# EAGLE design LandCruiser-Controller_1V1 (EAGLE 7.7.0)

## Sheet 1 of 7: MPU
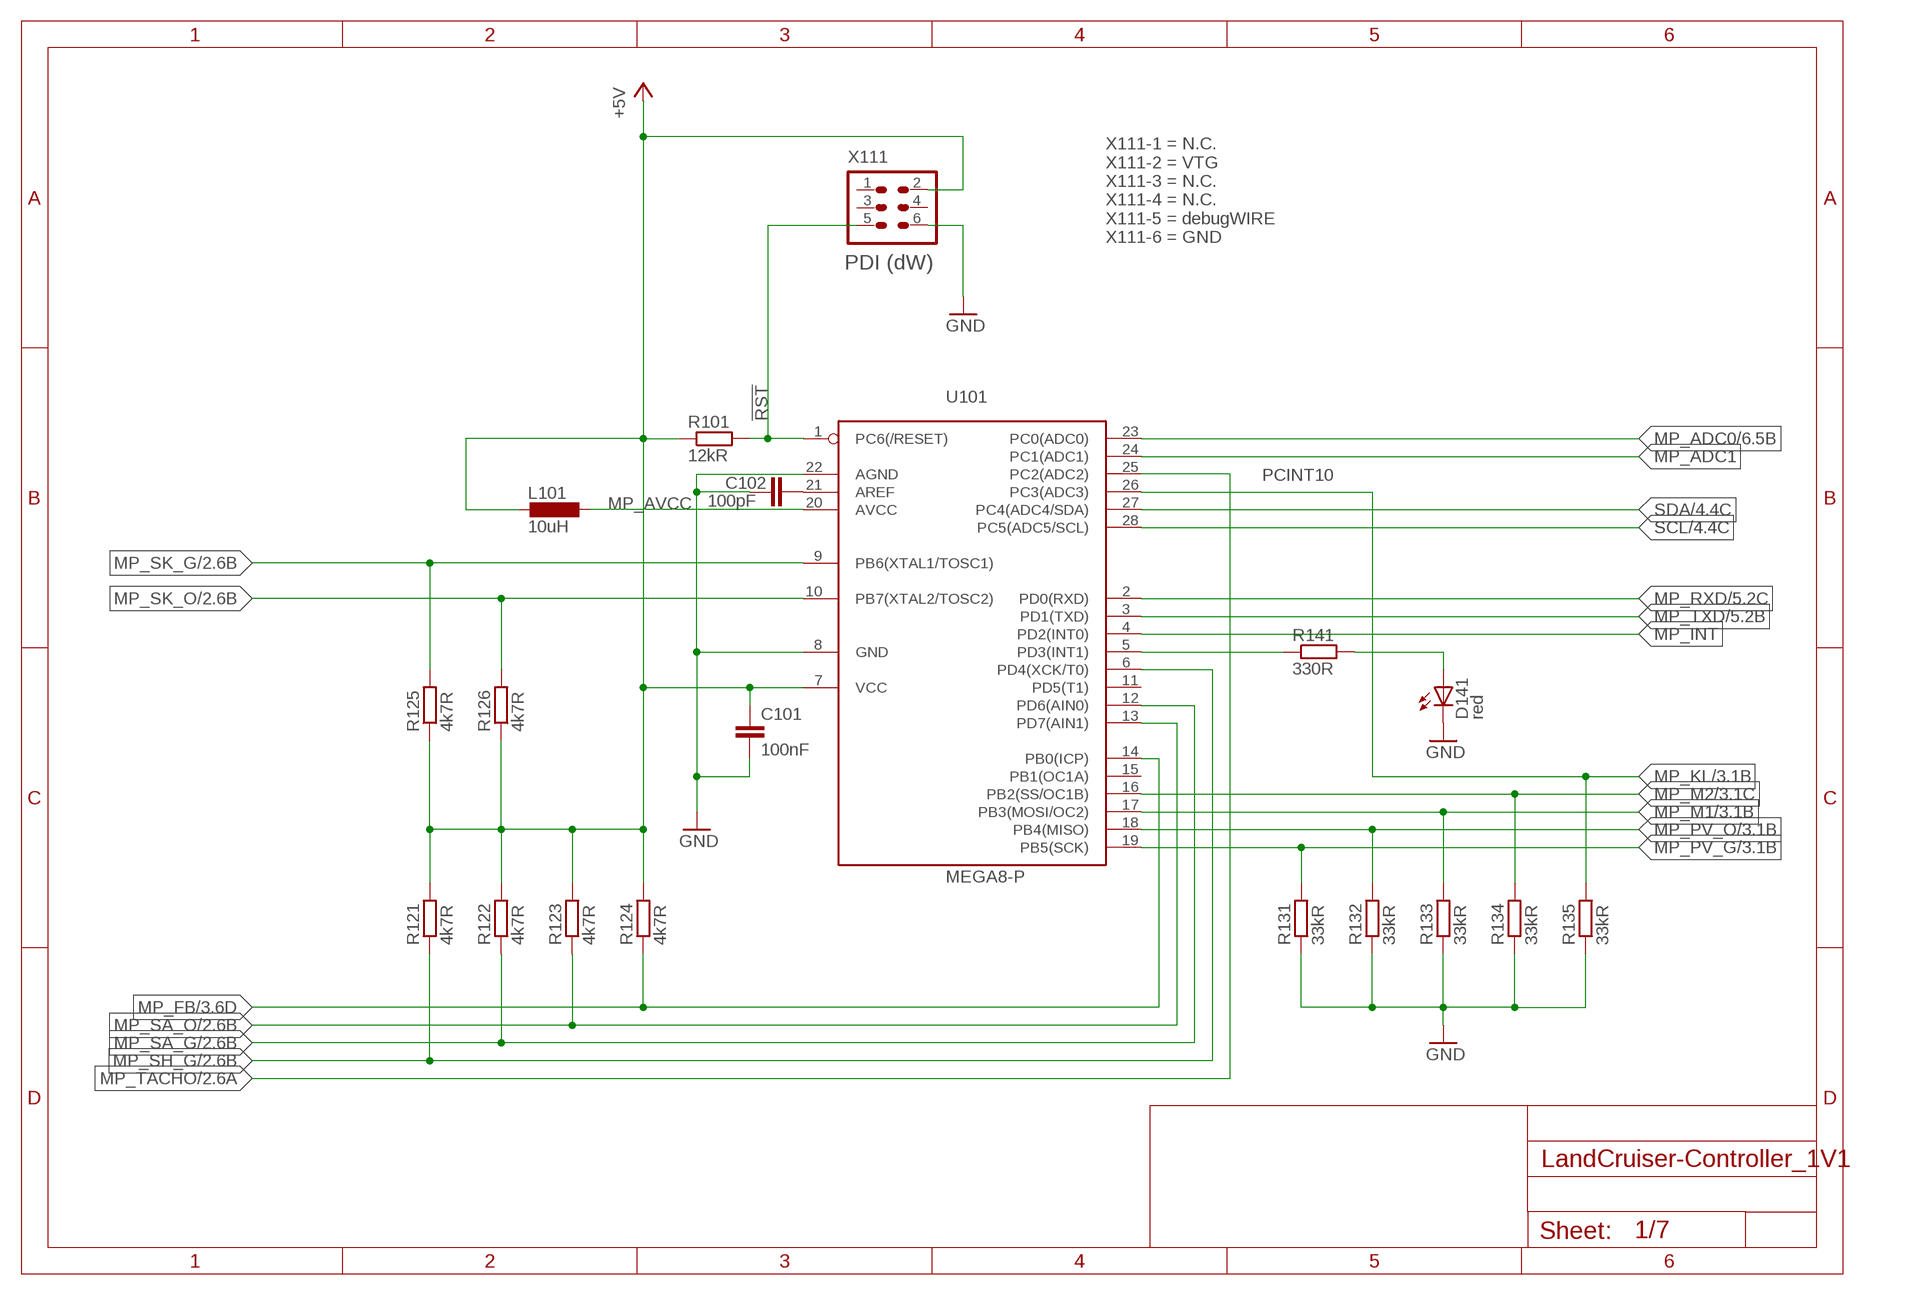
[diagram p0: schematic, sheet 1]

### Parts
C101  100nF  C-EUC0805  [C0805]
C102  100pF  C-EUC0805  [C0805]
D141  red  LED  [LED_2PIN-TTH]
L101  10uH  L-EUL1812  [L1812]
R101  12kR  R-EU_R0805  [R0805]
R121  4k7R  R-EU_R0805  [R0805]
R122  4k7R  R-EU_R0805  [R0805]
R123  4k7R  R-EU_R0805  [R0805]
R124  4k7R  R-EU_R0805  [R0805]
R125  4k7R  R-EU_R0805  [R0805]
R126  4k7R  R-EU_R0805  [R0805]
R131  33kR  R-EU_R0805  [R0805]
R132  33kR  R-EU_R0805  [R0805]
R133  33kR  R-EU_R0805  [R0805]
R134  33kR  R-EU_R0805  [R0805]
R135  33kR  R-EU_R0805  [R0805]
R141  330R  R-EU_R0805  [R0805]
U101  MEGA8-P  [DIL28-3]
X111  HEADER-2X3  [2X03]

### Nets
!RST: R101.2 U101.1(PC6(/RESET)) X111.5
+5V [pwr_ttl]: C101.1 L101.2 R101.1 R121.2 R122.2 R123.2 R124.2 R125.1 R126.1 U101.7(VCC) X111.2 ; also sheet 4,5,6
GND: C101.2 C102.1 D141.C R131.1 R132.1 R133.1 R134.1 R135.1 U101.8(GND) U101.22(AGND) X111.6 ; also sheet 2,3,4,5,6,7
LED_A: D141.A R141.2
MP_ADC0: U101.23(PC0(ADC0)) ; also sheet 6
MP_ADC1: U101.24(PC1(ADC1))
MP_AREF: C102.2 U101.21(AREF)
MP_AVCC: L101.1 U101.20(AVCC)
MP_FB: R124.1 U101.14(PB0(ICP)) ; also sheet 3
MP_INT: U101.4(PD2(INT0))
MP_KL: R135.2 U101.26(PC3(ADC3)) ; also sheet 3
MP_LED: R141.1 U101.5(PD3(INT1))
MP_M1: R133.2 U101.17(PB3(MOSI/OC2)) ; also sheet 3
MP_M2: R134.2 U101.16(PB2(SS/OC1B)) ; also sheet 3
MP_PV_G: R131.2 U101.19(PB5(SCK)) ; also sheet 3
MP_PV_O: R132.2 U101.18(PB4(MISO)) ; also sheet 3
MP_RXD: U101.2(PD0(RXD)) ; also sheet 5
MP_SA_G: R122.1 U101.12(PD6(AIN0)) ; also sheet 2
MP_SA_O: R123.1 U101.13(PD7(AIN1)) ; also sheet 2
MP_SH_G: R121.1 U101.6(PD4(XCK/T0)) ; also sheet 2
MP_SK_G: R125.2 U101.9(PB6(XTAL1/TOSC1)) ; also sheet 2
MP_SK_O: R126.2 U101.10(PB7(XTAL2/TOSC2)) ; also sheet 2
MP_TACHO: U101.25(PC2(ADC2)) ; also sheet 2
MP_TXD: U101.3(PD1(TXD)) ; also sheet 5
SCL: U101.28(PC5(ADC5/SCL)) ; also sheet 4
SDA: U101.27(PC4(ADC4/SDA)) ; also sheet 4
Unconnected: U101.11(PD5(T1)) U101.15(PB1(OC1A)) X111.1 X111.3 X111.4

### Notes on the sheet
- X111-1 = N.C.
  X111-2 = VTG
  X111-3 = N.C.
  X111-4 = N.C.
  X111-5 = debugWIRE
  X111-6 = GND
- PDI (dW)
- PCINT10

## Sheet 2 of 7: INPUT_Lines
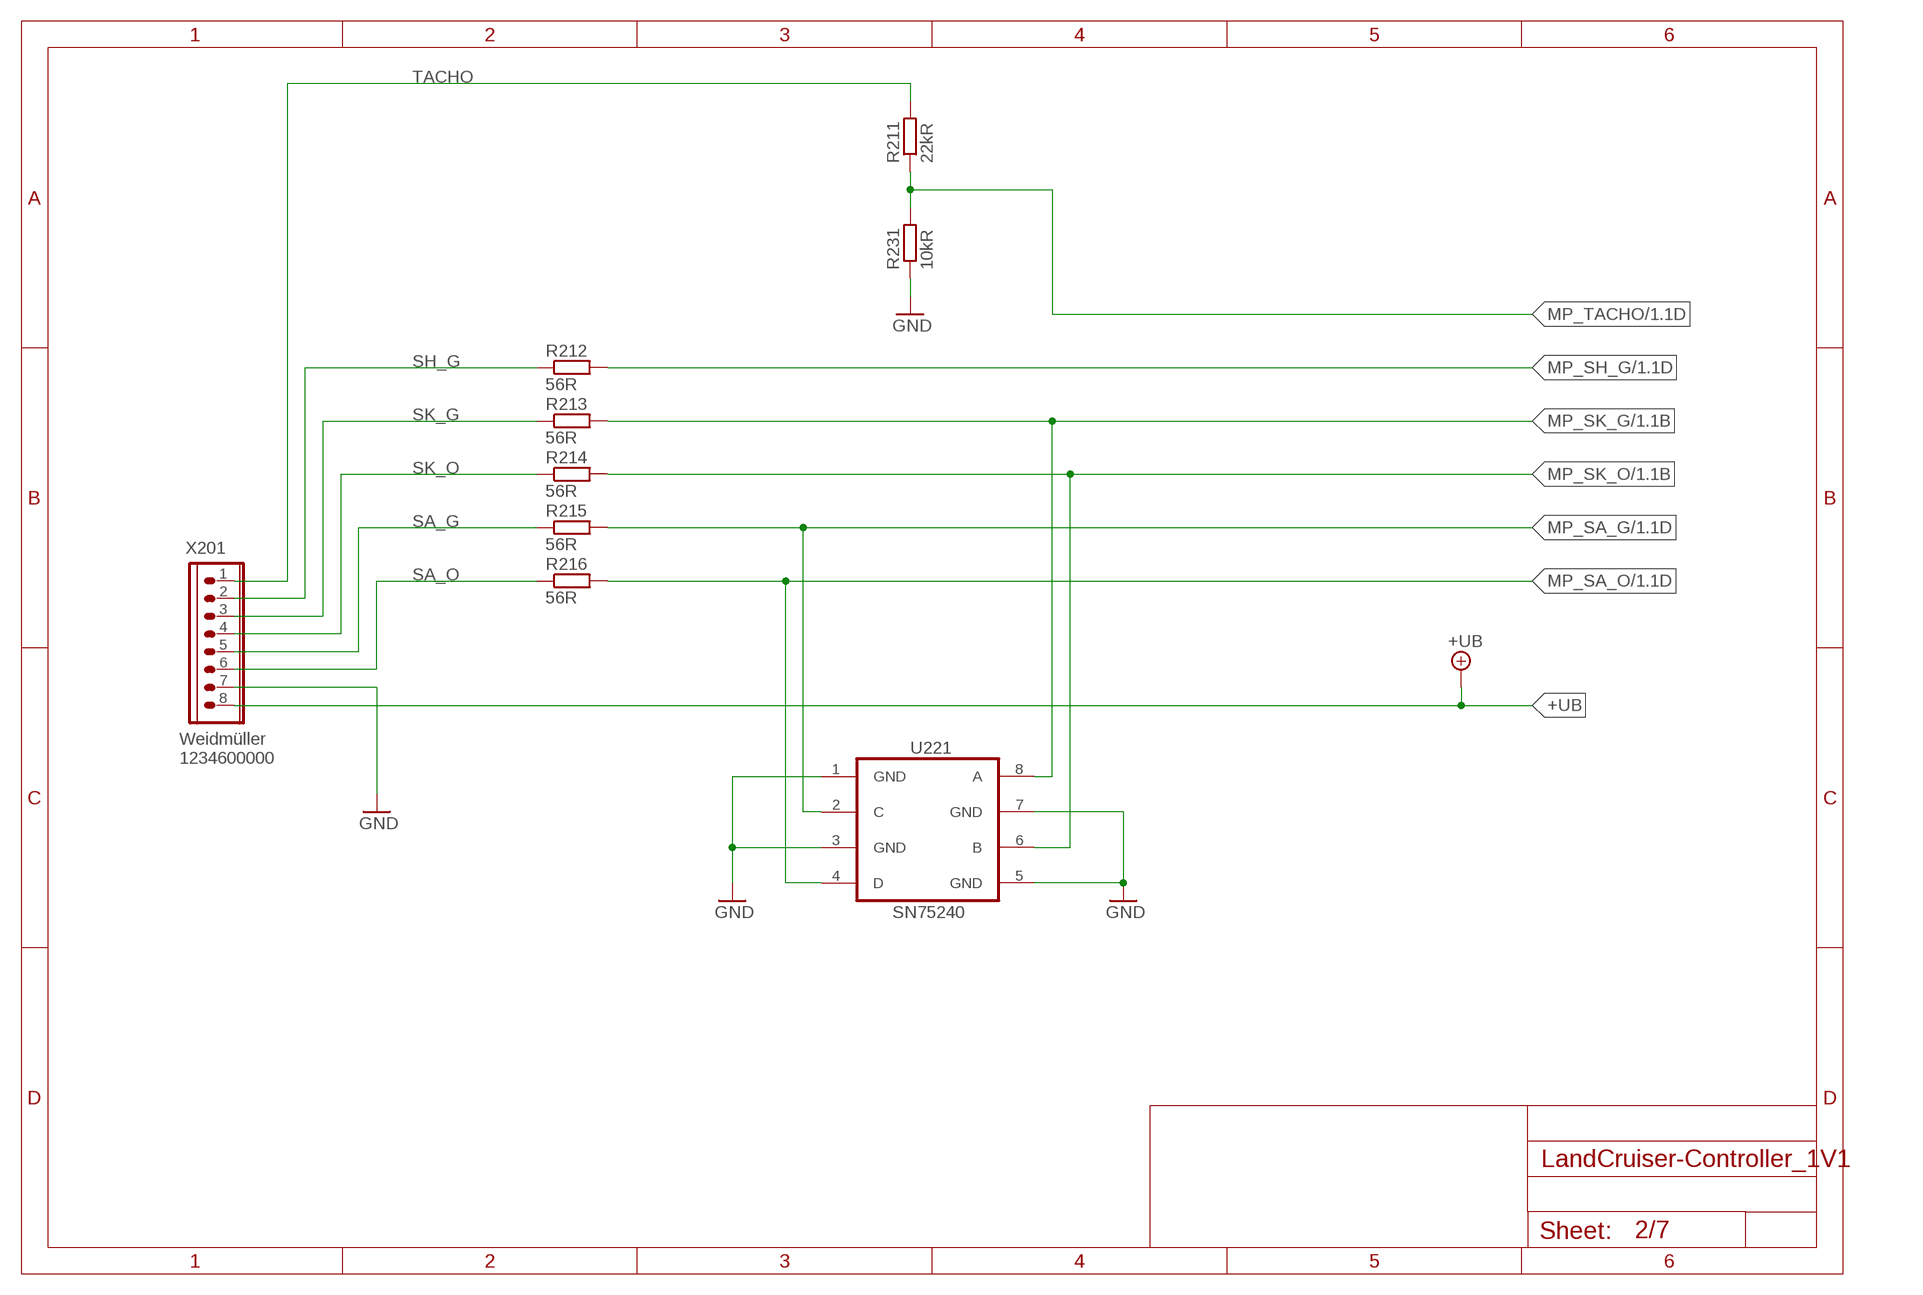
[diagram p1: schematic, sheet 2]

### Parts
R211  22kR  R-EU_R0805  [R0805]
R212  56R  R-EU_R0805  [R0805]
R213  56R  R-EU_R0805  [R0805]
R214  56R  R-EU_R0805  [R0805]
R215  56R  R-EU_R0805  [R0805]
R216  56R  R-EU_R0805  [R0805]
R231  10kR  R-EU_R0805  [R0805]
U221  SN75240  [TSSOP-8]
X201  WEIDMUELLER 1234600000  WIRE-TO-BOARD_5MM08_1X08  [WIRE-TO-BOARD_5MM08_1X08]

### Nets
+UB [pwr_relay]: X201.8 ; also sheet 6
GND: R231.1 U221.1(GND) U221.3(GND) U221.5(GND) U221.7(GND) X201.7 ; also sheet 1,3,4,5,6,7
MP_SA_G: R215.2 U221.2(C) ; also sheet 1
MP_SA_O: R216.2 U221.4(D) ; also sheet 1
MP_SH_G: R212.2 ; also sheet 1
MP_SK_G: R213.2 U221.8(A) ; also sheet 1
MP_SK_O: R214.2 U221.6(B) ; also sheet 1
MP_TACHO: R211.1 R231.2 ; also sheet 1
SA_G: R215.1 X201.5
SA_O: R216.1 X201.6
SH_G: R212.1 X201.2
SK_G: R213.1 X201.3
SK_O: R214.1 X201.4
TACHO: R211.2 X201.1

### Notes on the sheet
- Weidmüller
  1234600000

## Sheet 3 of 7: OUTPUT_Lines
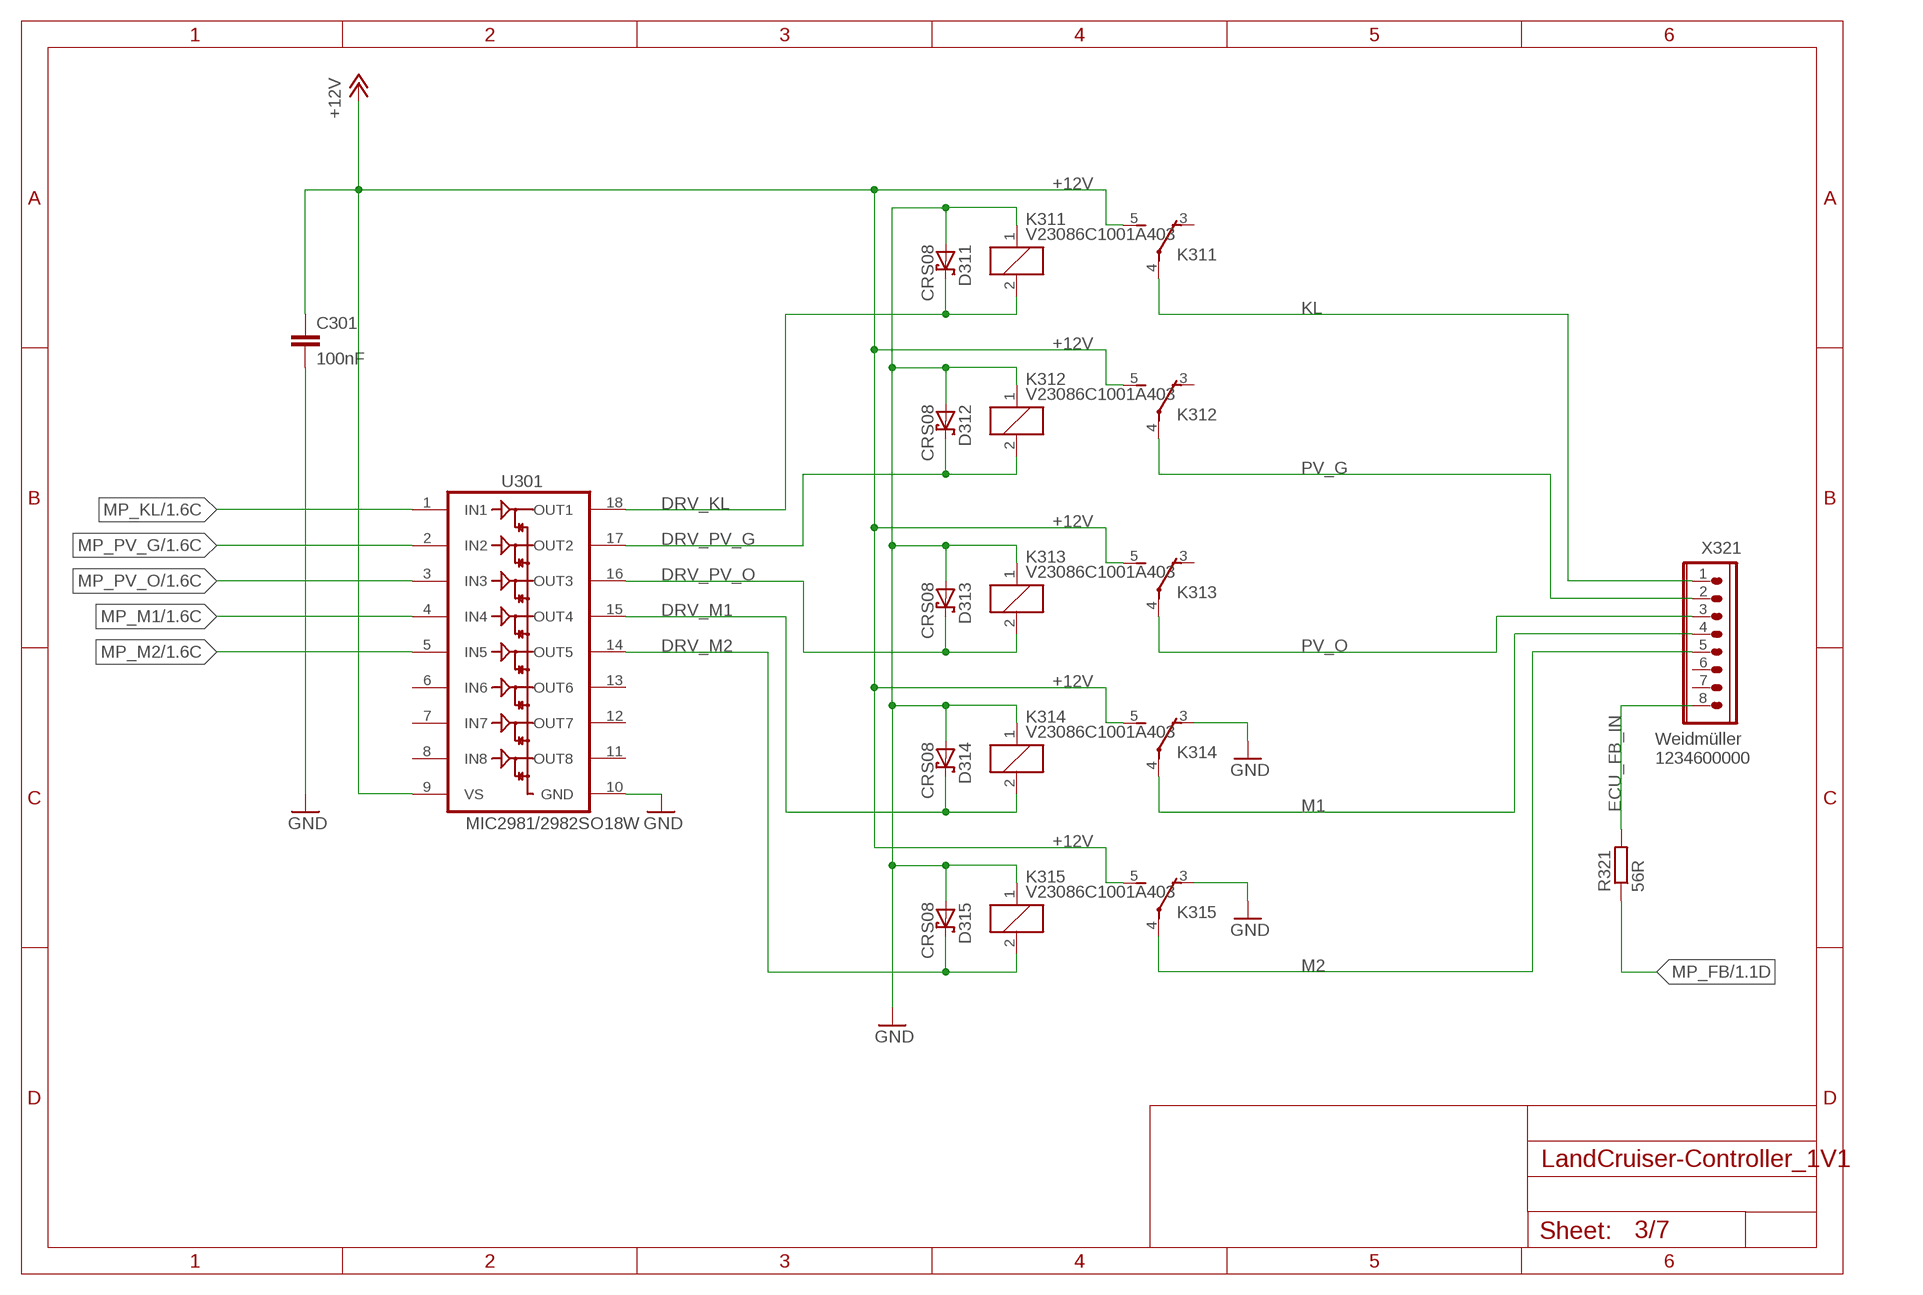
[diagram p2: schematic, sheet 3]

### Parts
C301  100nF  C-EUC0805  [C0805]
D311  CRS08  [SOD80C]
D312  CRS08  [SOD80C]
D313  CRS08  [SOD80C]
D314  CRS08  [SOD80C]
D315  CRS08  [SOD80C]
K311  V23086C1001A403  [V23086-CO]
K312  V23086C1001A403  [V23086-CO]
K313  V23086C1001A403  [V23086-CO]
K314  V23086C1001A403  [V23086-CO]
K315  V23086C1001A403  [V23086-CO]
R321  56R  R-EU_R0805  [R0805]
U301  MIC2981/2982SO18W  [SO-18W]
X321  WEIDMUELLER 1234600000  WIRE-TO-BOARD_5MM08_1X08  [WIRE-TO-BOARD_5MM08_1X08]

### Nets
+12V [pwr_relay]: C301.1 K311.5(2:S) K312.5(2:S) K313.5(2:S) K314.5(2:S) K315.5(2:S) U301.9(VS) ; also sheet 6
DRV_KL: D311.C K311.2 U301.18(OUT1)
DRV_M1: D314.C K314.2 U301.15(OUT4)
DRV_M2: D315.C K315.2 U301.14(OUT5)
DRV_PV_G: D312.C K312.2 U301.17(OUT2)
DRV_PV_O: D313.C K313.2 U301.16(OUT3)
ECU_FB_IN: R321.2 X321.8
GND: C301.2 D311.A D312.A D313.A D314.A D315.A K311.1 K312.1 K313.1 K314.1 K314.3(2:O) K315.1 K315.3(2:O) U301.10(GND) ; also sheet 1,2,4,5,6,7
KL [pwr_relay]: K311.4(2:P) X321.1
M1 [pwr_relay]: K314.4(2:P) X321.4
M2 [pwr_relay]: K315.4(2:P) X321.5
MP_FB: R321.1 ; also sheet 1
MP_KL: U301.1(IN1) ; also sheet 1
MP_M1: U301.4(IN4) ; also sheet 1
MP_M2: U301.5(IN5) ; also sheet 1
MP_PV_G: U301.2(IN2) ; also sheet 1
MP_PV_O: U301.3(IN3) ; also sheet 1
PV_G [pwr_relay]: K312.4(2:P) X321.2
PV_O [pwr_relay]: K313.4(2:P) X321.3
Unconnected: K311.3(2:O) K312.3(2:O) K313.3(2:O) U301.6(IN6) U301.7(IN7) U301.8(IN8) U301.11(OUT8) U301.12(OUT7) U301.13(OUT6) X321.6 X321.7

### Notes on the sheet
- Weidmüller
  1234600000

## Sheet 4 of 7: I2C connector
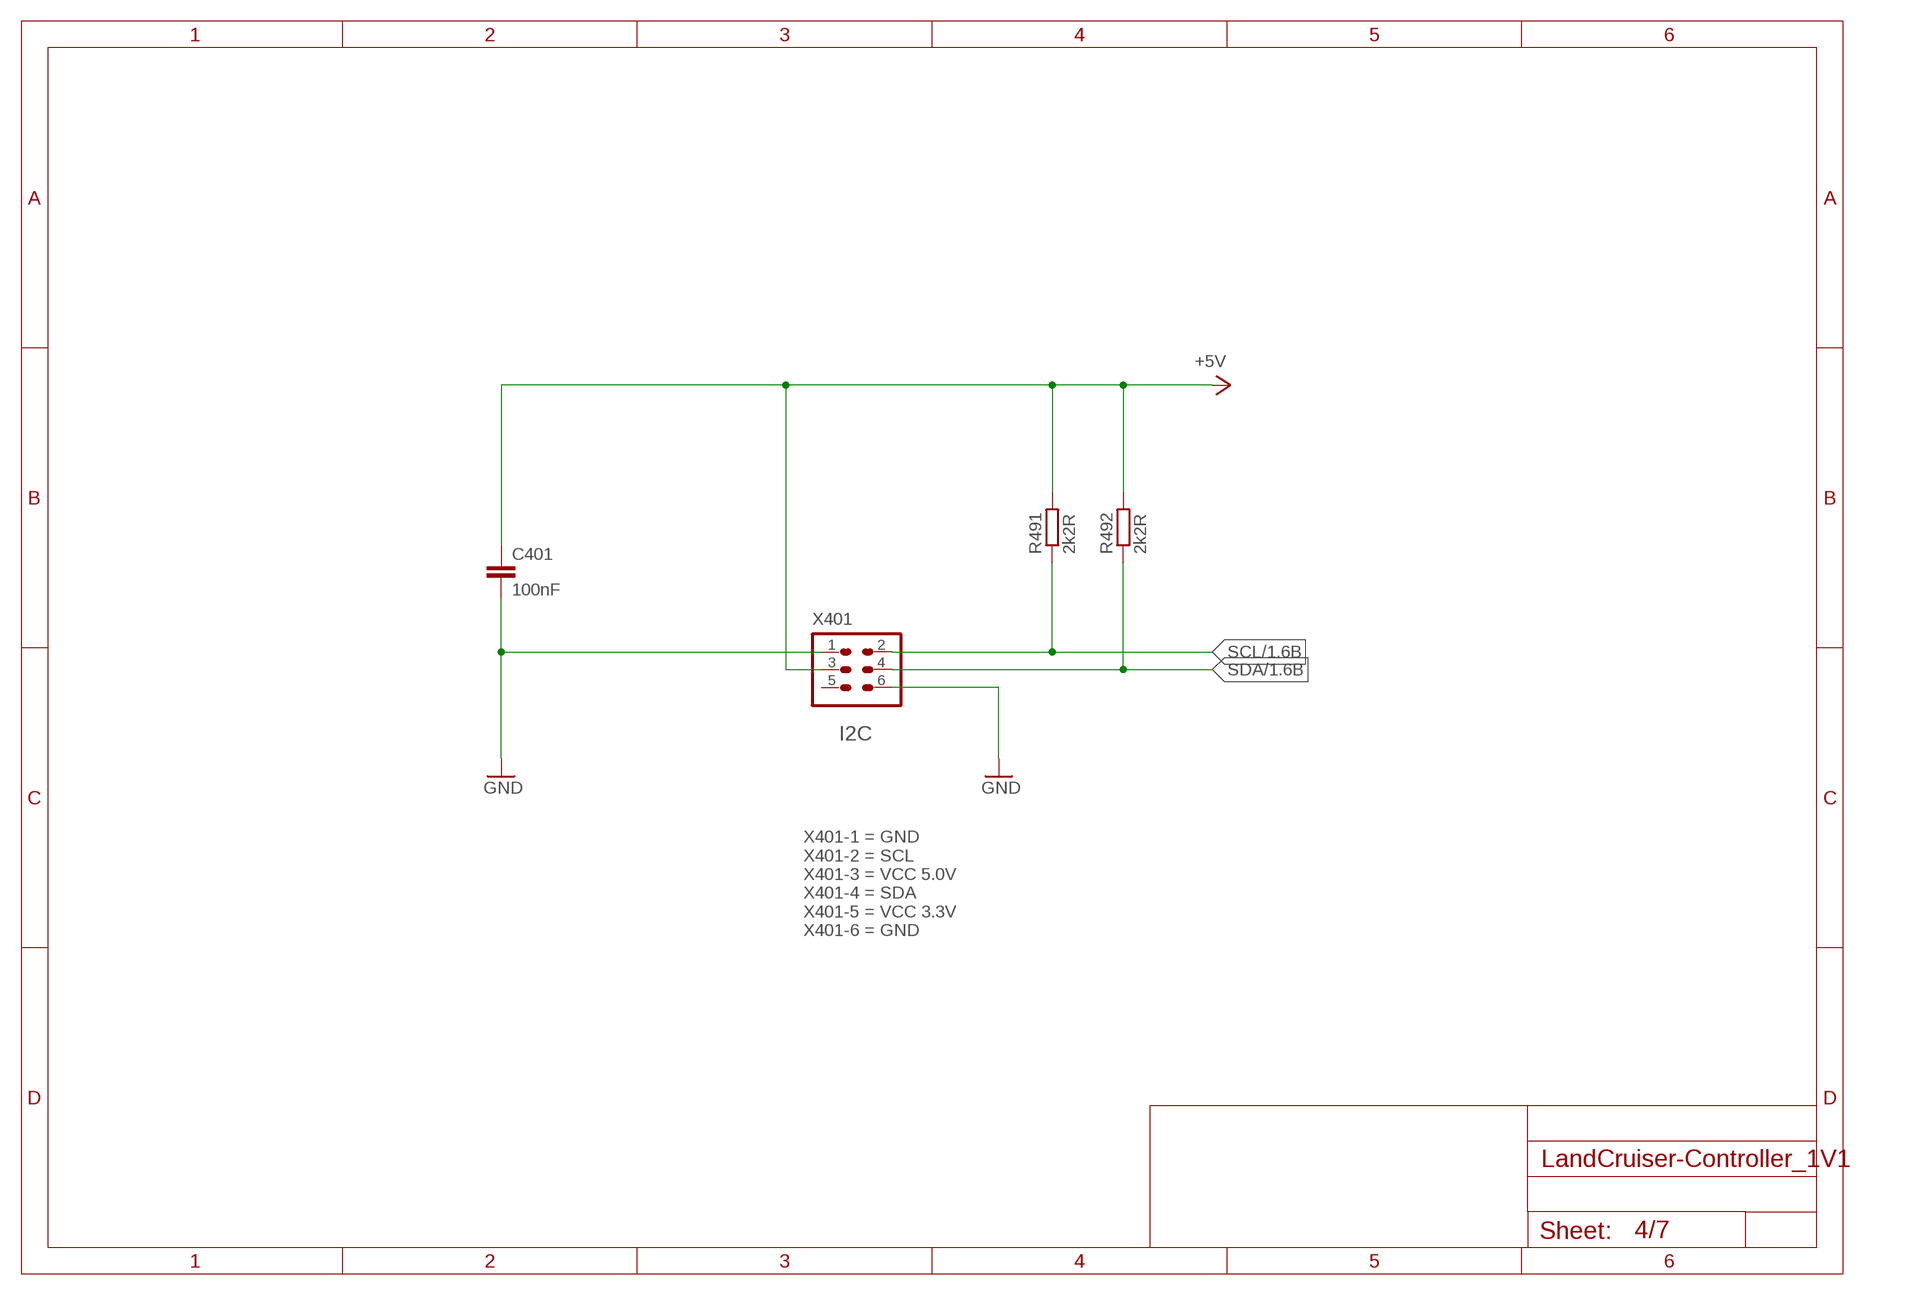
[diagram p3: schematic, sheet 4]

### Parts
C401  100nF  C-EUC0805  [C0805]
R491  2k2R  R-EU_R0805  [R0805]
R492  2k2R  R-EU_R0805  [R0805]
X401  I2C  HEADER-2X3  [2X03]

### Nets
+5V [pwr_ttl]: C401.1 R491.2 R492.2 X401.3 ; also sheet 1,5,6
GND: C401.2 X401.1 X401.6 ; also sheet 1,2,3,5,6,7
SCL: R491.1 X401.2 ; also sheet 1
SDA: R492.1 X401.4 ; also sheet 1
Unconnected: X401.5

### Notes on the sheet
- I2C
- X401-1 = GND
  X401-2 = SCL
  X401-3 = VCC 5.0V
  X401-4 = SDA
  X401-5 = VCC 3.3V
  X401-6 = GND

## Sheet 5 of 7: V24 level shifter
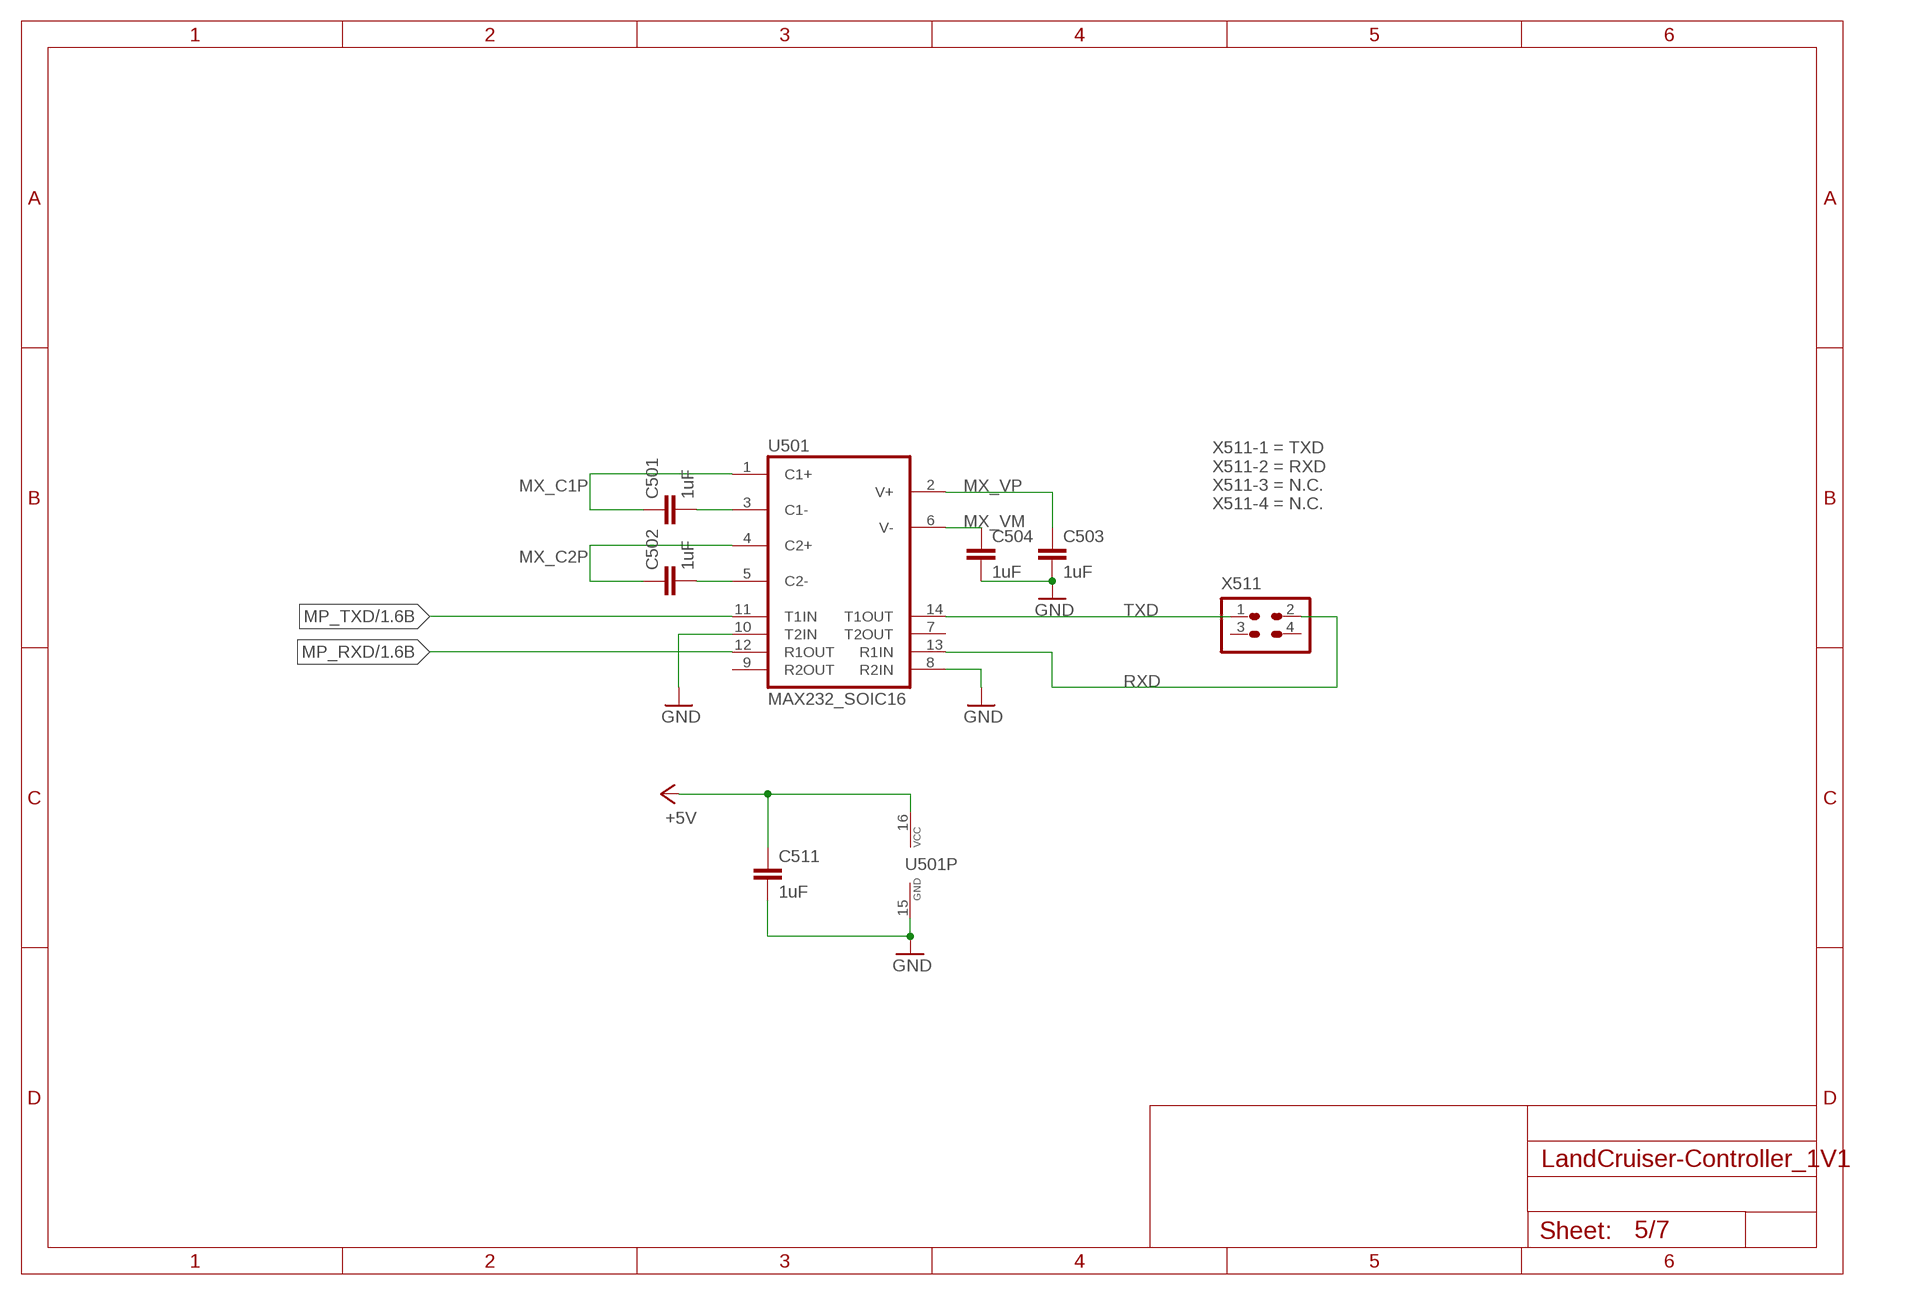
[diagram p4: schematic, sheet 5]

### Parts
C501  1uF  C-EUC0805  [C0805]
C502  1uF  C-EUC0805  [C0805]
C503  1uF  C-EUC0805  [C0805]
C504  1uF  C-EUC0805  [C0805]
C511  1uF  C-EUC0805  [C0805]
U501  MAX232_SOIC16  [SOIC16N]
X511  HEADER-2X2  [2X02]

### Nets
+5V [pwr_ttl]: C511.1 U501.16(VCC) ; also sheet 1,4,6
GND: C503.2 C504.2 C511.2 U501.8(R2IN) U501.10(T2IN) U501.15(GND) ; also sheet 1,2,3,4,6,7
MP_RXD: U501.12(R1OUT) ; also sheet 1
MP_TXD: U501.11(T1IN) ; also sheet 1
MX_C1N: C501.2 U501.3(C1-)
MX_C1P: C501.1 U501.1(C1+)
MX_C2M: C502.2 U501.5(C2-)
MX_C2P: C502.1 U501.4(C2+)
MX_VM: C504.1 U501.6(V-)
MX_VP: C503.1 U501.2(V+)
RXD: U501.13(R1IN) X511.2
TXD: U501.14(T1OUT) X511.1
Unconnected: U501.7(T2OUT) U501.9(R2OUT) X511.3 X511.4

### Notes on the sheet
- X511-1 = TXD
  X511-2 = RXD
  X511-3 = N.C.
  X511-4 = N.C.

## Sheet 6 of 7: Power
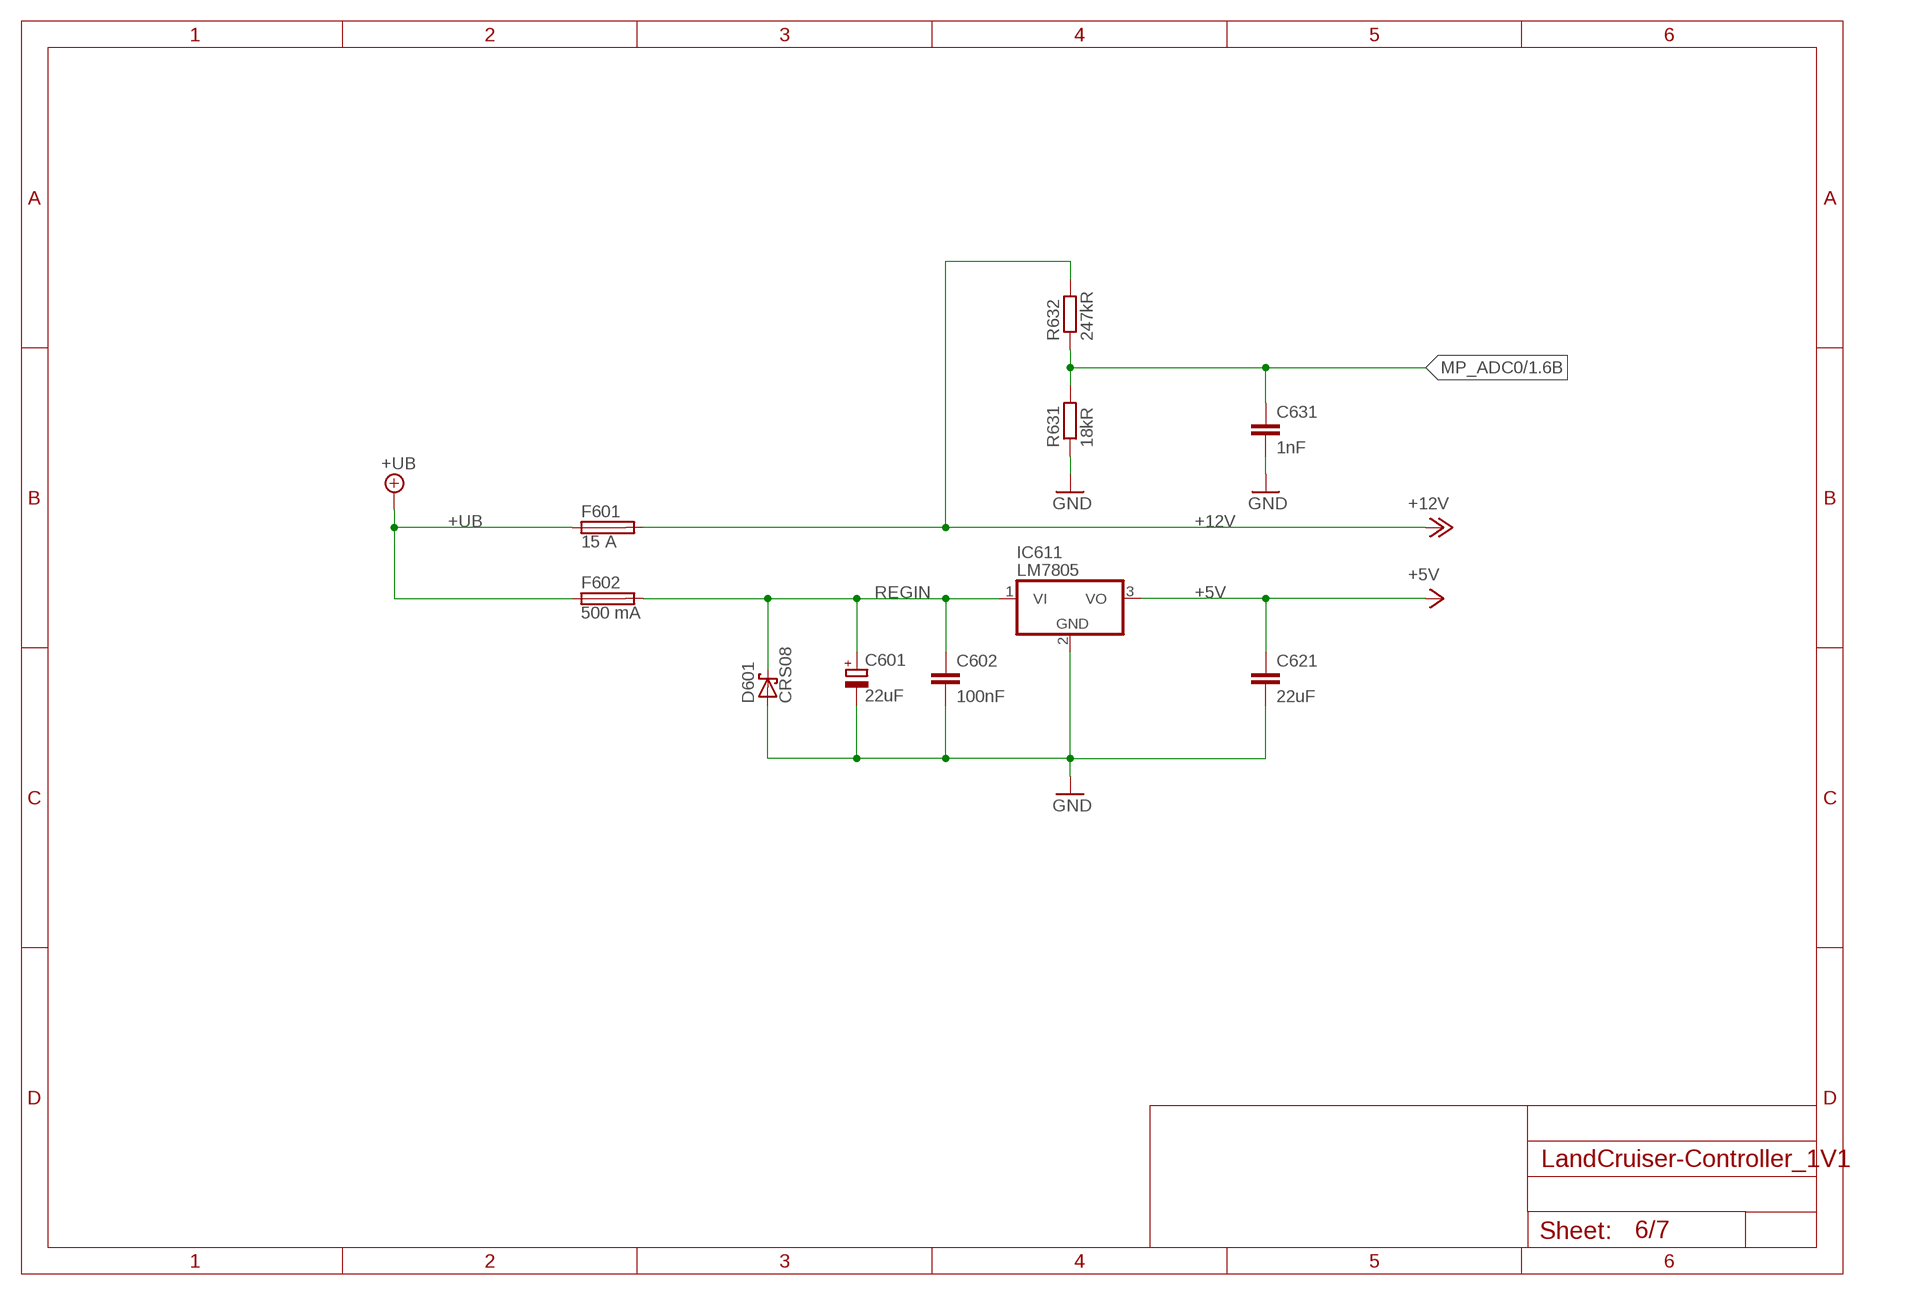
[diagram p5: schematic, sheet 6]

### Parts
C601  22uF  CPOL-EUE2.5-7  [E2,5-7]
C602  100nF  C-EUC0805  [C0805]
C621  22uF  C-EUC0805  [C0805]
C631  1nF  C-EUC0805  [C0805]
D601  CRS08  [SOD80C]
F601  15 A  MCCQ-121  [MCCQ-121]
F602  500 mA  MCCQ-121  [MCCQ-121]
IC611  LM7805  7805T  [TO220H]
R631  18kR  R-EU_R0805  [R0805]
R632  247kR  R-EU_R0805  [R0805]

### Nets
+5V [pwr_ttl]: C621.1 IC611.3(VO) ; also sheet 1,4,5
+12V [pwr_relay]: F601.3 F601.4 R632.2 ; also sheet 3
+UB [pwr_relay]: F601.1 F601.2 F602.1 F602.2 ; also sheet 2
GND: C601.- C602.2 C621.2 C631.2 D601.A IC611.2(GND) R631.1 ; also sheet 1,2,3,4,5,7
MP_ADC0: C631.1 R631.2 R632.1 ; also sheet 1
REGIN [pwr_ttl]: C601.+ C602.1 D601.C F602.3 F602.4 IC611.1(VI)

## Sheet 7 of 7: Holes
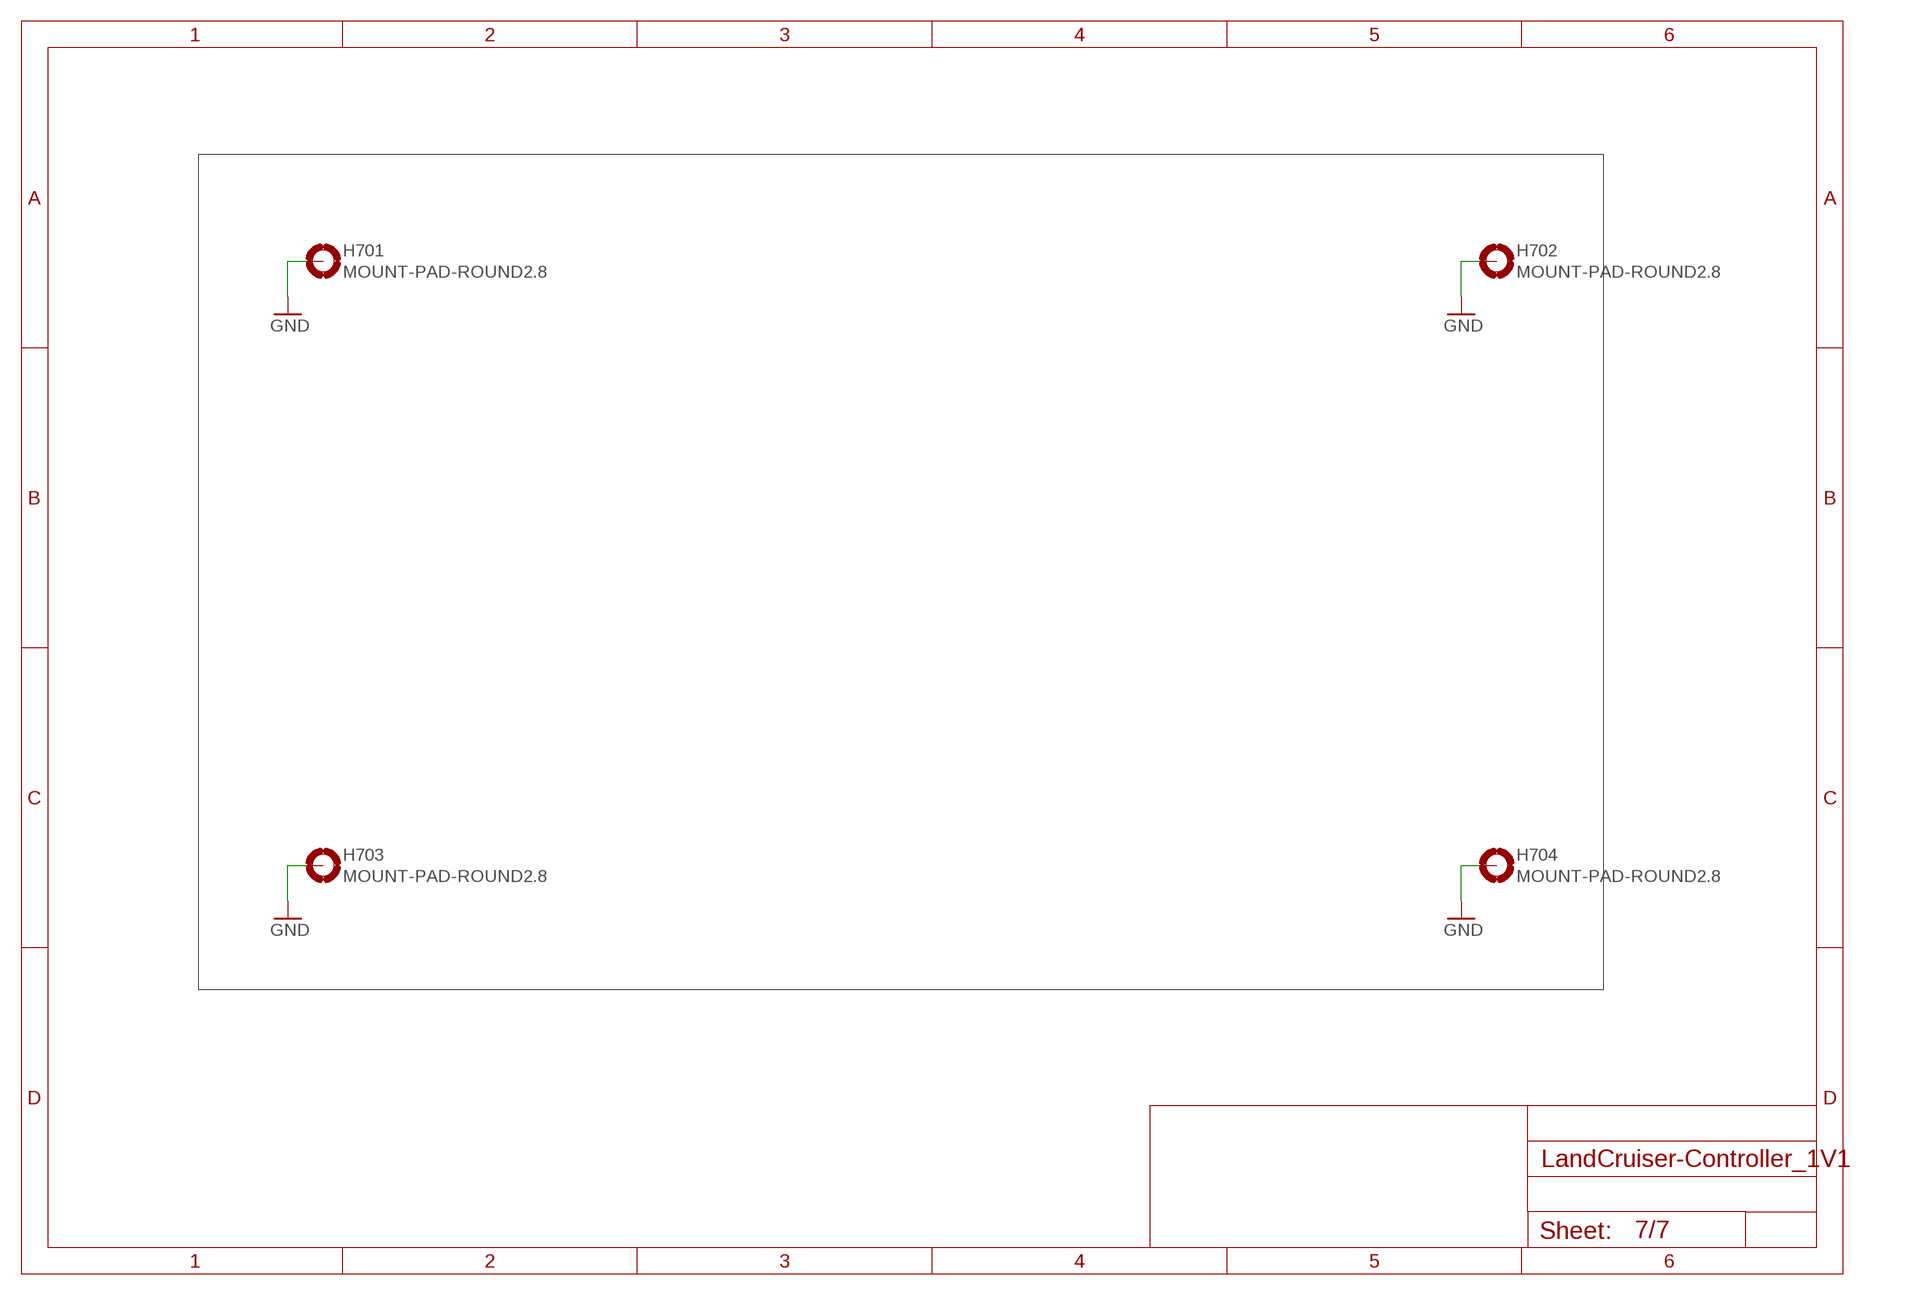
[diagram p6: schematic, sheet 7]

### Parts
H701  MOUNT-PAD-ROUND2.8  [2,8-PAD]
H702  MOUNT-PAD-ROUND2.8  [2,8-PAD]
H703  MOUNT-PAD-ROUND2.8  [2,8-PAD]
H704  MOUNT-PAD-ROUND2.8  [2,8-PAD]

### Nets
GND: H701.B2,8(MOUNT) H702.B2,8(MOUNT) H703.B2,8(MOUNT) H704.B2,8(MOUNT) ; also sheet 1,2,3,4,5,6

## Library data of the parts
C101 C102 C301 C401 C501-C504 C511 C602 C621 C631 = rcl:C-EU: CAPACITOR, European symbol
C601 = rcl:CPOL-EU: POLARIZED CAPACITOR, European symbol
D141 = df4iah_diode:LED: LED TTH, 5mm
D311-D315 D601 = df4iah_diode:CRS08: SCHOTTKY BARRIER RECTIFIER
F601 F602 = df4iah_fuse:MCCQ-121: minicomp Automotive Fuse-Holder MCCQ-121; MF: MINICOMP; MPN: MCCQ-121; OC_FARNELL: 1586596; OC_NEWARK: unknown
H701-H704 = holes:MOUNT-PAD-ROUND: MOUNTING PAD, round
IC611 = df4iah_powersupply:78*: Positive VOLTAGE REGULATOR Added bigger pads to the TO-92 package
K311-K315 = df4iah_relay:V23086C1001A403: Micro relay K, SPDT, 12 VDC, 30 A
L101 = rcl:L-EU: INDUCTOR, European symbol
R101 R121-R126 R131-R135 R141 R211-R216 R231 R321 R491 R492 R631 R632 = rcl:R-EU_: RESISTOR, European symbol
U101 = df4iah_processors:MEGA8-P: MICROCONTROLLER 8 Kbytes FLASH 1 kbytes SRAM 512 bytes EEPROM USART 4-channel 10 bit ADC 2-channel 8 bit ADC
U221 = df4iah_esd:SN75240: SN75240 ESD protection circuit for USB lines
U301 = df4iah_dataconvertion:MIC2981/2982: MICROCHIP MIC2981/2982 Open collector driver for 8 channels; MF: MICROCHIP; MP: MIC2981/82YWM-TR; OC_FARNELL: 2510054; OC_NEWARK: unknown
U501 = df4iah_dataconvertion:MAX232: RS232 TRANSCEIVER; MF: MAXIM; MPN: MAX232ECDR; OC_FARNELL: 2463694; OC_NEWARK: unknown
X111 X401 = df4iah_connector:HEADER-2X3: Header 2X3 2.54mm
X201 X321 = df4iah_connector:WIRE-TO-BOARD_5MM08_1X08: Wire-to-Board connector 5.08mm 1x08
X511 = df4iah_connector:HEADER-2X2: Header 2X2 2.54mm

## Net classes
1 pwr_relay: width 1.5 mm, clearance 0.5 mm
2 pwr_ttl: width 0.75 mm, clearance 0.5 mm

## Board
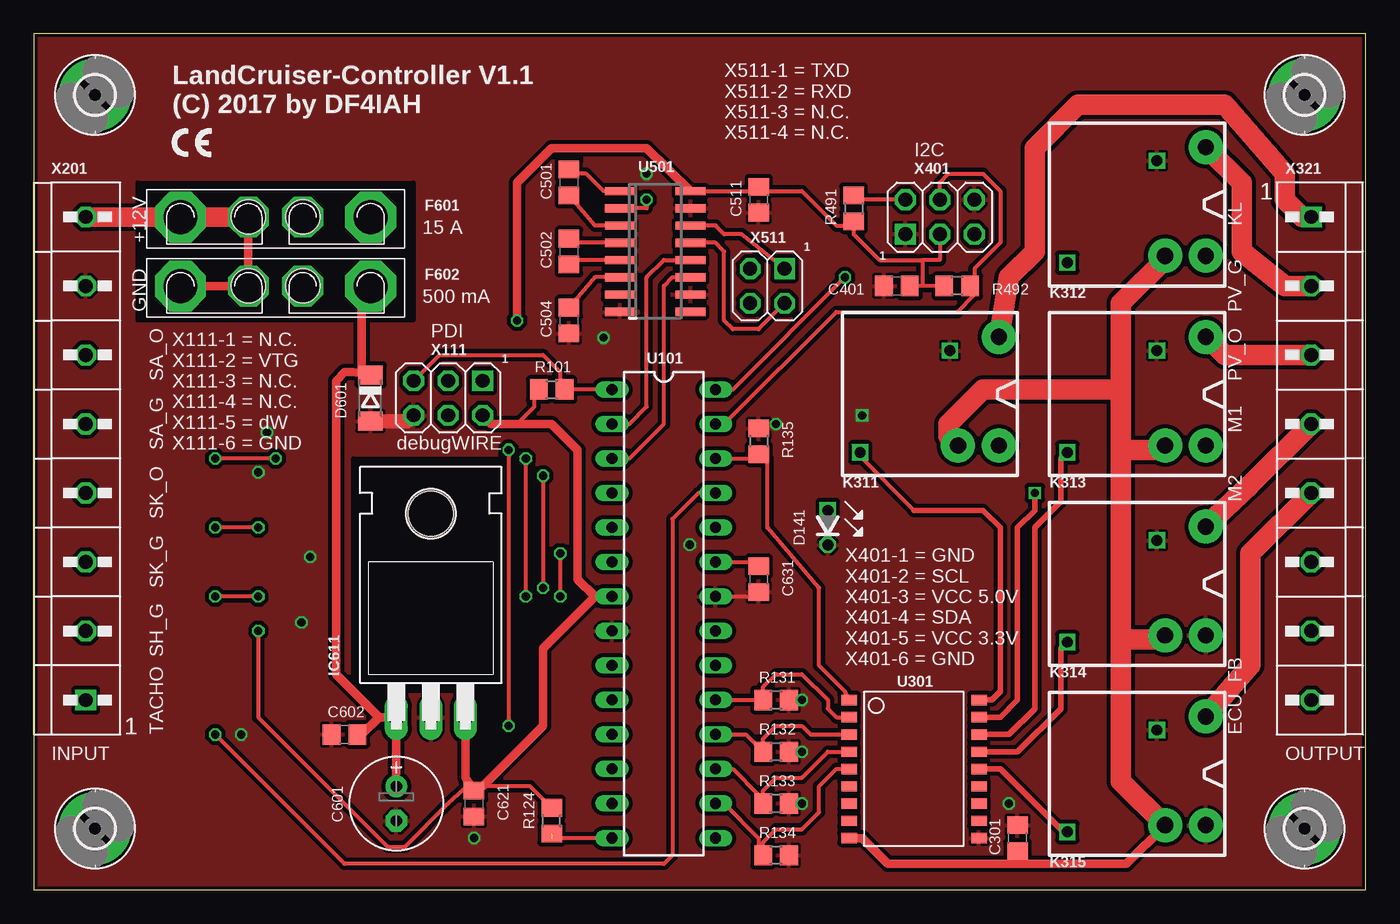
[diagram p7: board, top side]
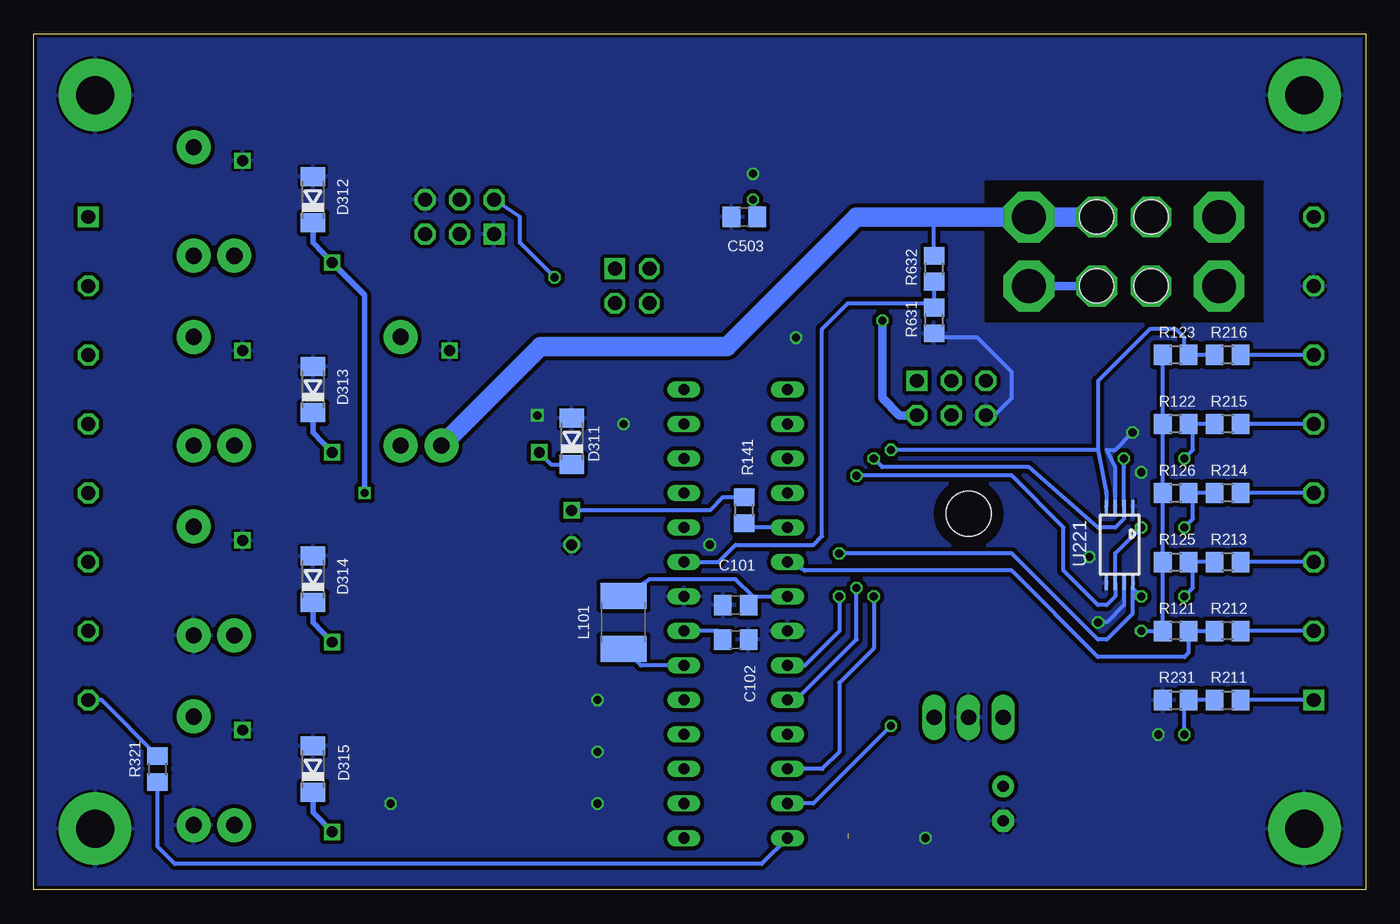
[diagram p8: board, bottom side, seen from below]

Size 98 x 63 mm. Coordinates in mm from the lower left corner, seen from the top.
Outline: 0,0 98,0 98,63 0,63 0,0
Copper layers (1*16): Top 0.035mm / dielectric 1.45mm / Bottom 0.035mm
Design rules "LandCruiser-Controller_1V0 *": minimum track width 0.3mm, minimum drill 0.3mm, track to track 0.3mm, track to pad 0.5mm, pad to pad 0.3mm, via to via 0.3mm, smd to smd 0mil, copper to edge 0.25mm, drill to drill 0.35mm, minimum pad ring 0.175mm, minimum via ring 0.125mm, stop-mask expansion 0.05mm, vias tented up to drill 0.35mm, thermal gap 0.2mm
Holes 2.5 mm at 15.78,49.53 15.78,44.45 19.78,44.45 19.78,49.53
tRestrict: area 23.5,14.6 to 34.9,31.8; area 7.6,41.9 to 27.9,52.1
bRestrict: area 7.6,41.9 to 27.9,52.1

### Footprints (pad centres in the part's own frame; a part is rotated, then mirrored left to right if it is on the bottom)
C0805 = smd 1.3 x 1.5: 1 -0.95,0; 2 0.95,0
E2,5-7 = drill 0.813 pad 1.6: + -1.27,0 | drill 0.813 pad 1.6 octagon: - 1.27,0
LED_2PIN-TTH = drill 0.813 square: A -2.54,0 | drill 0.813 octagon: C 0,0
SOD80C = smd 1.4 x 1.8: A 1.7,0; C -1.7,0
MCCQ-121 = drill 2.5 pad 2.8 octagon: 1 -7,0; 4 7,0 | drill 2 pad 2.5 octagon: 2 -2,0; 3 2,0
2,8-PAD = drill 2.8 pad 5.334: B2,8 0,0
TO220H = drill 1.118 long: 1 -2.54,-10.16; 2 0,-10.16; 3 2.54,-10.16 | hole 3.302: 0,4.826
V23086-CO = drill 0.8 square: 1 -9.22,-4.98; 2 -1.72,-11.58 | drill 1.2 pad 2.5: 3 -2.22,-1.38; 4 -10.22,-1.38; 5 -2.22,-4.38
L1812 = smd 1.9 x 3.4: 1 -1.95,0; 2 1.95,0
R0805 = smd 1.3 x 1.5: 1 -0.95,0; 2 0.95,0
DIL28-3 = drill 0.813 long: 1 -16.51,-3.81; 2 -13.97,-3.81; 3 -11.43,-3.81; 4 -8.89,-3.81; 5 -6.35,-3.81; 6 -3.81,-3.81; 7 -1.27,-3.81; 8 1.27,-3.81; 9 3.81,-3.81; 10 6.35,-3.81; 11 8.89,-3.81; 12 11.43,-3.81; 13 13.97,-3.81; 14 16.51,-3.81; 15 16.51,3.81; 16 13.97,3.81; 17 11.43,3.81; 18 8.89,3.81; 19 6.35,3.81; 20 3.81,3.81; 21 1.27,3.81; 22 -1.27,3.81; 23 -3.81,3.81; 24 -6.35,3.81; 25 -8.89,3.81; 26 -11.43,3.81; 27 -13.97,3.81; 28 -16.51,3.81
TSSOP-8 = smd 0.25 x 1: 1 -0.975,-2.813; 2 -0.325,-2.813; 3 0.325,-2.813; 4 0.975,-2.813; 5 0.975,2.813; 6 0.325,2.813; 7 -0.325,2.813; 8 -0.975,2.813
SO-18W = smd 0.762 x 1.143: 1 -5.08,-4.788; 2 -3.81,-4.788; 3 -2.54,-4.788; 4 -1.27,-4.788; 5 0,-4.788; 6 1.27,-4.788; 7 2.54,-4.788; 8 3.81,-4.788; 9 5.08,-4.788; 10 5.08,4.788; 11 3.81,4.788; 12 2.54,4.788; 13 1.27,4.788; 14 0,4.788; 15 -1.27,4.788; 16 -2.54,4.788; 17 -3.81,4.788; 18 -5.08,4.788
SOIC16N = smd 0.6 x 2.2: 1 -4.445,-2.6; 2 -3.175,-2.6; 3 -1.905,-2.6; 4 -0.635,-2.6; 5 0.635,-2.6; 6 1.905,-2.6; 7 3.175,-2.6; 8 4.445,-2.6; 9 4.445,2.6; 10 3.175,2.6; 11 1.905,2.6; 12 0.635,2.6; 13 -0.635,2.6; 14 -1.905,2.6; 15 -3.175,2.6; 16 -4.445,2.6
2X03 = drill 1.016 square: 1 -2.54,-1.27 | drill 1.016 octagon: 2 -2.54,1.27; 3 0,-1.27; 4 0,1.27; 5 2.54,-1.27; 6 2.54,1.27
WIRE-TO-BOARD_5MM08_1X08 = drill 1.016 square: 1 0,17.78 | drill 1.016 octagon: 2 0,12.7; 3 0,7.62; 4 0,2.54; 5 0,-2.54; 6 0,-7.62; 7 0,-12.7; 8 0,-17.78
2X02 = drill 1.016 square: 1 -1.27,-1.27 | drill 1.016 octagon: 2 -1.27,1.27; 3 1.27,-1.27; 4 1.27,1.27

### Placement (x,y rotation side)
C101  46.35,20.95 180 bottom
C102  46.35,18.41 180 bottom
C301  72.39,3.81 90 top
C401  63.5,44.45 180 top
C501  39.37,52.07 270 top
C502  39.37,46.99 270 top
C503  45.72,49.53 180 bottom
C504  39.37,41.91 270 top
C511  53.34,50.8 270 top
C601  26.67,6.35 270 top
C602  22.86,11.43 180 top
C621  32.38,6.35 270 top
C631  53.34,22.86 270 top
D141  58.42,25.4 270 top
D311  58.42,33.02 90 bottom
D312  77.47,50.8 90 bottom
D313  77.47,36.83 90 bottom
D314  77.47,22.86 90 bottom
D315  77.47,8.89 90 bottom
D601  24.77,36.2 270 top
F601  17.78,49.53 0 top
F602  17.78,44.45 0 top
H701  4.5,58.5 0 top
H702  93.5,58.5 0 top
H703  4.5,4.5 0 top
H704  93.5,4.5 0 top
IC611  29.21,22.86 0 top
K311  72.39,30.48 270 top
K312  87.63,44.45 270 top
K313  87.63,30.48 270 top
K314  87.63,16.51 270 top
K315  87.63,2.54 270 top
L101  54.61,19.68 90 bottom
R101  38.1,36.83 0 top
R121  13.97,19.05 180 bottom
R122  13.97,34.29 180 bottom
R123  13.97,39.37 180 bottom
R124  38.1,5.08 90 top
R125  13.97,24.13 0 bottom
R126  13.97,29.21 0 bottom
R131  54.61,13.97 180 top
R132  54.61,10.16 180 top
R133  54.61,6.35 180 top
R134  54.61,2.54 180 top
R135  53.34,33.02 270 top
R141  45.72,27.94 90 bottom
R211  10.16,13.97 0 bottom
R212  10.16,19.05 180 bottom
R213  10.16,24.13 180 bottom
R214  10.16,29.21 180 bottom
R215  10.16,34.29 180 bottom
R216  10.16,39.37 180 bottom
R231  13.97,13.97 0 bottom
R321  88.9,8.89 90 bottom
R491  60.33,50.16 270 top
R492  67.94,44.45 180 top
R631  31.75,41.91 90 bottom
R632  31.75,45.72 90 bottom
U101  46.35,20.32 270 top
U221  18.1,25.4 180 bottom
U301  64.77,8.89 270 top
U501  45.72,46.99 270 top
X111  30.48,36.2 180 top
X201  3.81,31.75 180 top
X321  94,31.75 0 top
X401  66.67,49.53 0 top
X511  53.98,44.45 180 top

### Tracks (layer width: path | path; a pad name or v marks a point on that pad's centre or on a via)
!RST
  Top 0.305: U101.1 R101.2 38.73,37.47 38.73,38.1 37.47,39.37 29.84,39.37 X111.5
+5V  (via drill 0.6)
  Top 0.305: U501.16 52.7,51.44 | U101.7 41.27,21.59 | v16.51,19.05 16.51,12.7 26.04,3.17 27.3,3.17 30.48,6.35 32.04,7.82 | 35.56,34.29 36.83,35.56 36.83,36.2 R101.1 | X401.3 66.67,46.35 65.41,46.35 | 65.41,46.35 65.41,44.45 | R492.2 65.41,44.45 | 65.41,44.45 C401.1 | C511.1 52.7,51.44 | 52.7,51.44 56.52,51.44 59.05,48.9 60.33,48.9 | 60.33,48.9 R491.2 | 60.33,48.9 60.33,48.26 62.23,46.35 65.41,46.35 | R124.2 36.51,7.62 33.02,7.62
  Top 0.61: IC611.3 31.75,8.26 32.04,7.82 C621.1 33.02,7.62 37.47,12.06 37.47,17.78 41.27,21.59 40.01,22.86 40.01,32.38 38.1,34.29 35.56,34.29 33.66,34.29 X111.2 | U501.16 45.09,54.61 38.1,54.61 35.56,52.07 v35.56,41.91
  Bottom 0.305: 45.09,21.59 U101.7 | C101.1 45.09,21.59 | 45.09,21.59 46.35,22.86 52.7,22.86 L101.2 | v16.51,19.05 R121.2 R125.1 R126.1 R122.2 R123.2
  Bottom 0.61: v35.56,41.91 35.56,36.2 34.29,34.92 X111.2
+12V
  Top 0.61: U301.9 60.96,3.81 62.87,1.91 72.39,1.91 | 72.39,1.91 80.39,1.91 K315.5 | C301.1 72.39,1.91
  Top 1.5: K315.5 80.01,8 80.01,18.41 | 80.01,18.41 80.01,32.38 | 80.01,32.38 80.01,36.83 | 80.01,36.83 80.01,43.18 83.25,46.42 K312.5 | K314.5 82.94,18.41 80.01,18.41 | K313.5 82.94,32.38 80.01,32.38 | K311.5 67.31,33.4 67.31,34.29 69.85,36.83 80.01,36.83
  Bottom 0.305: R632.2 31.75,49.53
  Bottom 1.422: F601.3 F601.4 31.75,49.53 37.47,49.53 46.99,40.01 60.7,40.01 K311.5
+UB
  Top 0.61: F602.1 F602.2 F601.2
  Top 1.422: X201.8 F601.1 F601.2
DRV_KL
  Top 0.305: 64.77,27.94 60.81,31.9 K311.2
  Top 0.406: U301.18 70.48,13.97 71.12,14.61 71.12,26.67 69.85,27.94 64.77,27.94
  Bottom 0.305: K311.2 59.93,31.32 D311.C
DRV_M1
  Top 0.406: U301.15 72.39,10.16 75.56,13.34 75.56,17.78 76.02,18.23 K314.2
  Bottom 0.406: K314.2 77.47,19.68 D314.C
DRV_M2
  Top 0.305: 75.56,4.45 75.75,4.26 K315.2
  Top 0.406: U301.14 71.12,8.89 75.56,4.45
  Bottom 0.406: K315.2 77.47,5.71 D315.C
DRV_PV_G  (via drill 0.6)
  Top 0.406: U301.17 71.12,12.7 72.39,13.97 72.39,26.67 73.66,27.94 v73.66,29.21
  Bottom 0.406: D312.C 77.47,47.62 K312.2 73.66,43.78 v73.66,29.21
DRV_PV_O
  Top 0.406: U301.16 71.75,11.43 73.66,13.34 73.66,26.67 75.56,28.57 75.56,31.75 76.02,32.2 K313.2
  Bottom 0.406: K313.2 77.47,33.66 D313.C
ECU_FB_IN
  Bottom 0.305: R321.2 93.03,13.97 X321.8
GND  (via drill 0.6)
  Top 0.305: U101.22 53.02,21.59 C631.2 | R135.1 53.66,34.29
  Top 1.016: D601.A 27.51,34.49 X111.6
  Bottom 0.305: U221.7 17.78,20.95 19.05,19.68 v19.68,19.68 | U221.3 18.43,29.2 18.41,29.21 18.41,31.11 19.05,32.38 18.41,32.38 v17.14,33.66 | X111.6 27.3,34.92 26.04,36.2 26.04,38.1 28.57,40.64 31.43,40.64 R631.1 | D311.A 58.62,34.92
  other vias: 32.38,3.81 20.32,24.51 15.24,11.43 41.91,40.64 45.09,52.7 48.26,25.4 54.61,34.29 56.52,13.97 56.52,10.16 56.52,6.35 71.75,6.35 16.51,30.73 60.96,34.92
  pour Bottom: 0,0 0,63 98,63 98,0
  pour Top: 0,0 0,63 98,63 98,0
KL
  Top 1.5: X321.1 93.34,49.53 92.08,50.8 92.08,52.7 87.63,57.78 76.83,57.78 73.66,54.61 73.66,46.99 71.75,45.09 71.12,41.27 K311.4
LED_A
  Bottom 0.305: R141.2 47.31,28.89 48.26,27.94 D141.A
M1
  Top 1.5: K314.4 89.53,29.84 X321.4
M2
  Top 1.5: K315.4 89.53,16.51 89.53,24.77 X321.5
MP_ADC0
  Top 0.305: U101.23 53.02,24.13 C631.1
  Bottom 0.305: R632.1 R631.2 32.07,43.18 38.1,43.18 40.01,41.27 40.01,26.04 40.64,25.4 46.35,25.4 47.62,24.13 U101.23
MP_AREF
  Bottom 0.305: C102.2 47.62,19.05 U101.21
MP_AVCC
  Bottom 0.305: U101.20 53.34,16.51 L101.1
MP_FB  (1 unrouted)
  Top 0.305: U101.14 38.1,3.81
  Bottom 0.305: U101.14 44.45,1.91 87.63,1.91 88.9,3.17 R321.1
MP_KL
  Top 0.305: U101.26 52.7,31.75 R135.2 53.98,31.75 53.98,26.67 57.78,22.23 57.78,16.51 59.69,14.61 U301.1
MP_LED
  Bottom 0.305: U101.5 45.72,26.67 R141.1
MP_M1
  Top 0.305: U101.17 51.44,8.89 53.34,6.99 53.34,6.67 R133.2 53.66,7.3 54.61,8.26 56.52,8.26 58.42,10.16 U301.4
MP_M2
  Top 0.305: U101.16 50.8,6.35 53.34,3.81 53.34,2.86 R134.2 53.66,3.5 54.61,4.45 56.52,4.45 57.78,5.71 57.78,7.62 59.05,8.89 U301.5
MP_PV_G
  Top 0.305: U101.19 R131.2 53.66,14.93 54.61,15.88 56.52,15.88 58.42,13.97 58.42,13.34 59.05,12.7 U301.2
MP_PV_O
  Top 0.305: U101.18 52.39,11.43 R132.2 53.66,11.12 54.61,12.06 56.52,12.06 57.15,11.43 U301.3
MP_RXD
  Top 0.305: U101.2 43.81,34.29 45.09,35.56 45.09,45.09 46.35,46.35 U501.12
MP_SA_G  (via drill 0.6)
  Top 0.305: v17.78,31.75 v13.34,31.75 | v36.2,31.75 v36.2,21.59
  Bottom 0.305: R215.2 R122.1 12.7,33.66 12.7,32.38 v13.34,31.75 | v17.78,31.75 17.78,31.11 U221.2 17.77,27.31 18.41,26.67 19.68,26.67 24.77,31.11 35.56,31.11 v36.2,31.75 | v36.2,21.59 36.2,17.78 38.73,15.24 38.73,10.16 40.01,8.89 U101.12
MP_SA_O  (via drill 0.6)
  Top 0.305: v34.92,32.38 v34.92,12.06
  Bottom 0.305: R216.2 R123.1 13.34,40.01 13.34,40.64 13.97,41.27 15.88,41.27 19.68,37.47 19.68,32.38 | 19.68,32.38 19.07,29.21 U221.4 | 19.68,32.38 v34.92,32.38 | v34.92,12.06 40.64,6.35 U101.13
MP_SH_G
  Bottom 0.305: U101.6 41.27,23.5 26.04,23.5 19.68,17.14 13.34,17.14 13.02,17.46 R121.1 R212.2
MP_SK_G  (via drill 0.6)
  Top 0.305: v16.51,21.59 v13.34,21.59 | v38.73,24.77 v38.73,21.59
  Bottom 0.305: R213.2 R125.2 12.7,23.5 12.7,22.23 v13.34,21.59 | U221.8 17.14,22.23 | 17.14,22.23 v16.51,21.59 | 17.14,22.23 17.14,20.32 19.05,18.41 19.68,18.41 26.04,24.77 v38.73,24.77 | v38.73,21.59 38.73,19.05 41.27,16.51 U101.9
MP_SK_O  (via drill 0.6)
  Top 0.305: v16.51,26.67 v13.34,26.67 | v37.47,30.48 v37.47,22.23
  Bottom 0.305: R214.2 R126.2 12.7,28.57 12.7,27.3 v13.34,26.67 | v16.51,26.67 18.41,24.77 18.41,24.13 U221.6 18.43,21.6 18.41,21.59 19.05,20.95 19.68,20.95 22.23,23.5 22.23,26.67 26.04,30.48 v37.47,30.48 | U101.10 41.91,13.97 37.47,18.41 v37.47,22.23
MP_TACHO  (via drill 0.6)
  Top 0.305: U101.25 48.9,29.21 46.99,27.3 46.99,2.54 46.35,1.91 22.86,1.91 v13.34,11.43
  Bottom 0.305: R211.1 R231.2 13.34,13.65 v13.34,11.43
MP_TXD
  Top 0.305: U101.3 43.81,31.75 46.35,34.29 46.35,44.45 46.99,45.09 U501.11
MX_C1N
  Top 0.305: U501.3 41.27,48.9 C501.2
MX_C1P
  Top 0.305: U501.1 41.91,51.44 40.64,52.7 40.01,52.7 C501.1
MX_C2M
  Top 0.305: U501.5 40.01,46.35 C502.2
MX_C2P
  Top 0.305: U501.4 40.01,47.62 C502.1
MX_VM
  Top 0.305: U501.6 41.27,45.09 C504.1
MX_VP  (via drill 0.6)
  Top 0.305: v45.09,50.8 45.09,50.16 U501.2
  Bottom 0.305: C503.1 44.45,50.16 45.09,50.16 v45.09,50.8
PV_G
  Top 1.5: K312.4 88.9,52.07 88.9,46.99 92.08,44.45 X321.2
PV_O
  Top 1.5: K313.4 86.36,40.64 87.63,39.37 X321.3
REGIN
  Top 0.305: C602.1 24.13,11.43
  Top 0.61: C601.+ IC611.1 25.4,12.7 | 25.4,12.7 22.23,15.88 22.23,37.47 22.86,38.1 23.5,38.1 D601.C 24.13,38.1 24.13,43.18 F602.4 | 24.13,11.43 25.4,12.7
  Bottom 0.61: F602.4 F602.3
RXD
  Top 0.305: X511.2 53.34,41.27 51.44,41.27 50.8,41.91 50.8,46.99 50.16,47.62 U501.13
SA_G
  Bottom 0.305: X201.5 R215.1
SA_O
  Bottom 0.305: X201.6 R216.1
SCL  (via drill 0.6)
  Top 0.305: X401.2 60.96,50.8 R491.1 | U101.28 51.44,36.83 v59.69,45.09
  Bottom 0.305: v59.69,45.09 62.23,47.62 62.23,49.53 X401.2
SDA
  Top 0.305: U101.27 50.8,34.29 59.05,42.55 67.94,42.55 69.22,43.81 R492.1 69.22,44.77 69.22,45.72 71.12,47.62 71.12,51.44 69.85,52.7 67.31,52.7 66.67,52.07 X401.4
SH_G
  Bottom 0.305: X201.2 R212.1
SK_G
  Bottom 0.305: X201.3 R213.1
SK_O
  Bottom 0.305: X201.4 R214.1
TACHO
  Bottom 0.305: X201.1 R211.2
TXD
  Top 0.305: X511.1 52.07,48.26 50.8,48.26 50.16,48.9 U501.14

### Text on the board
tPlace: LandCruiser-Controller V1.1 / (C) 2017 by DF4IAH | X511-1 = TXD / X511-2 = RXD / X511-3 = N.C. / X511-4 = N.C. | I2C | KL | +12V | 15 A | 1 | 1 | GND | 500 mA | PV_G | PDI | 1 | SA_O | PV_O | M1 | SA_G | X111-1 = N.C. / X111-2 = VTG / X111-3 = N.C. / X111-4 = N.C. / X111-5 = dW / X111-6 = GND | debugWIRE | M2 | SK_O | SK_G | SH_G | X401-1 = GND / X401-2 = SCL / X401-3 = VCC 5.0V / X401-4 = SDA / X401-5 = VCC 3.3V / X401-6 = GND | TACHO | ECU_FB | INPUT | OUTPUT
tDocu: 4x 2.8 mm